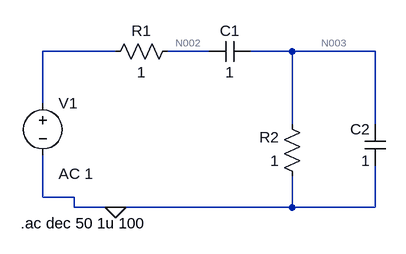
[diagram p0: schematic realim-osc.asc]
realim-osc.asc, the LTspice schematic file:
Version 4
SHEET 1 880 680
WIRE 112 144 0 144
WIRE 256 144 192 144
WIRE 384 144 320 144
WIRE 512 144 384 144
WIRE 0 224 0 144
WIRE 384 256 384 144
WIRE 512 256 512 144
WIRE 0 368 0 304
WIRE 48 368 0 368
WIRE 48 384 48 368
WIRE 112 384 48 384
WIRE 384 384 384 336
WIRE 384 384 112 384
WIRE 512 384 512 320
WIRE 512 384 384 384
FLAG 112 384 0
SYMBOL res 400 352 R180
WINDOW 0 36 76 Left 2
WINDOW 3 36 40 Left 2
SYMATTR InstName R2
SYMATTR Value 1
SYMBOL cap 320 128 R90
WINDOW 0 0 32 VBottom 2
WINDOW 3 32 32 VTop 2
SYMATTR InstName C1
SYMATTR Value 1
SYMBOL cap 528 320 R180
WINDOW 0 24 56 Left 2
WINDOW 3 24 8 Left 2
SYMATTR InstName C2
SYMATTR Value 1
SYMBOL voltage 0 208 R0
WINDOW 123 24 124 Left 2
WINDOW 39 0 0 Left 0
SYMATTR InstName V1
SYMATTR Value ""
SYMATTR Value2 AC 1
SYMBOL res 208 128 R90
WINDOW 0 0 56 VBottom 2
WINDOW 3 32 56 VTop 2
SYMATTR InstName R1
SYMATTR Value 1
TEXT -34 408 Left 2 !.ac dec 50 1u 100

The netlist it stands for:
* realim-osc.asc
R2 0 N003 1
C1 N003 N002 1
C2 0 N003 1
V1 N001 0 AC 1
R1 N002 N001 1
.ac dec 50 1u 100
.backanno
.end

* Results of the author's LTspice run, read from the files saved beside the schematic
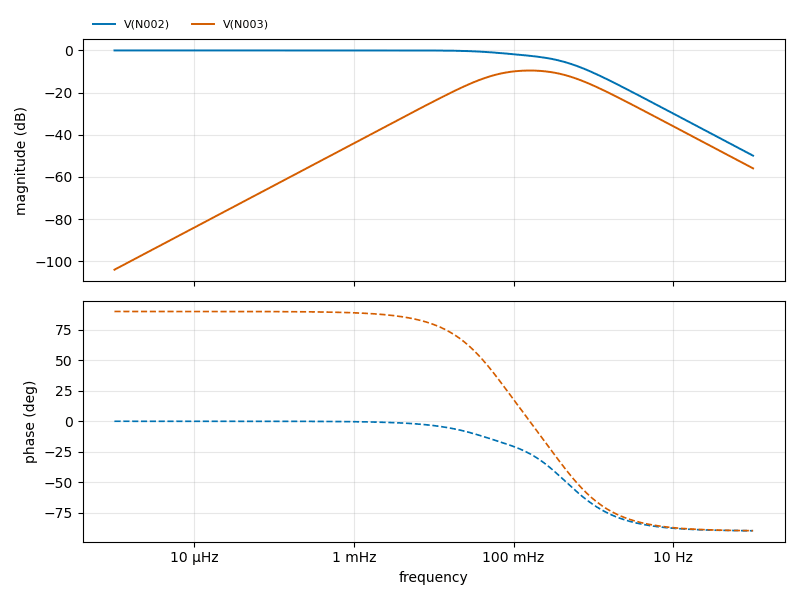
[diagram p1: AC Analysis of realim-osc.asc, plotted from the saved traces]
* AC Analysis, 1 run:
*   V(N002): -0.00 dB at 1 µHz, -49.94 dB at 100 Hz, peak -0.00 dB at 1 µHz, 3 dB below the peak at 202.4 mHz
*   V(N003): -104.04 dB at 1 µHz, -55.96 dB at 100 Hz, peak -9.54 dB at 158.5 mHz, 3 dB below the peak at 48.19 mHz and 525.6 mHz